# Altium schematic sheet TK531_Utgangstrinn.SchDoc
size A4
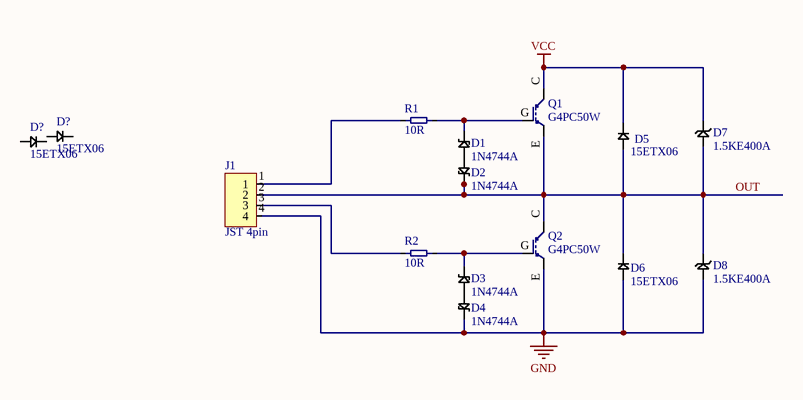
[diagram p0: TK531_Utgangstrinn.SchDoc]

## Parts
(Parts that share a designator on the sheet are numbered #1, #2 ... from top to bottom, then left to right.)
D1  1N4744A  [DO-41]
D2  1N4744A  [DO-41]
D3  1N4744A  [DO-41]
D4  1N4744A  [DO-41]
D5  15ETX06  [TO-220]
D6  15ETX06  [TO-220]
D7  1.5KE400A  [DO-201]
D8  1.5KE400A  [DO-201]
D?#1  15ETX06  [TO-220]
D?#2  15ETX06  [TO-220]
J1  JST 4pin  [JST 4pin]
Q1  G4PC50W  [TO-247]
Q2  G4PC50W  [TO-247]
R1  10R  [Axial 1/4W]
R2  10R  [Axial 1/4W]

## Nets
GND: D4.K D6.1(A) D8.A J1.4 Q2.E
VCC: D5.3(K) D7.K Q1.C
OUT: D2.K D5.1(A) D6.3(K) D7.A D8.K J1.2 Q1.E Q2.C
NetD1_A: D1.A D2.A
NetD1_K: D1.K Q1.G R1.2
NetD3_A: D3.A D4.A
NetD3_K: D3.K Q2.G R2.2
NetJ1_1: J1.1 R1.1
NetJ1_3: J1.3 R2.1

Not connected (* = marked no-connect by the designer): D?#1 1(A) 3(K); D?#2 1(A) 3(K)

## Library data of the parts
D5 D6 D?#1 D?#2 = 15ETX06: pin to pad: 1>3 3>1
R1 R2 = R: Value: 10R